# Altium schematic sheet [03] - Module Sim.SchDoc
size 381 x 266 mm
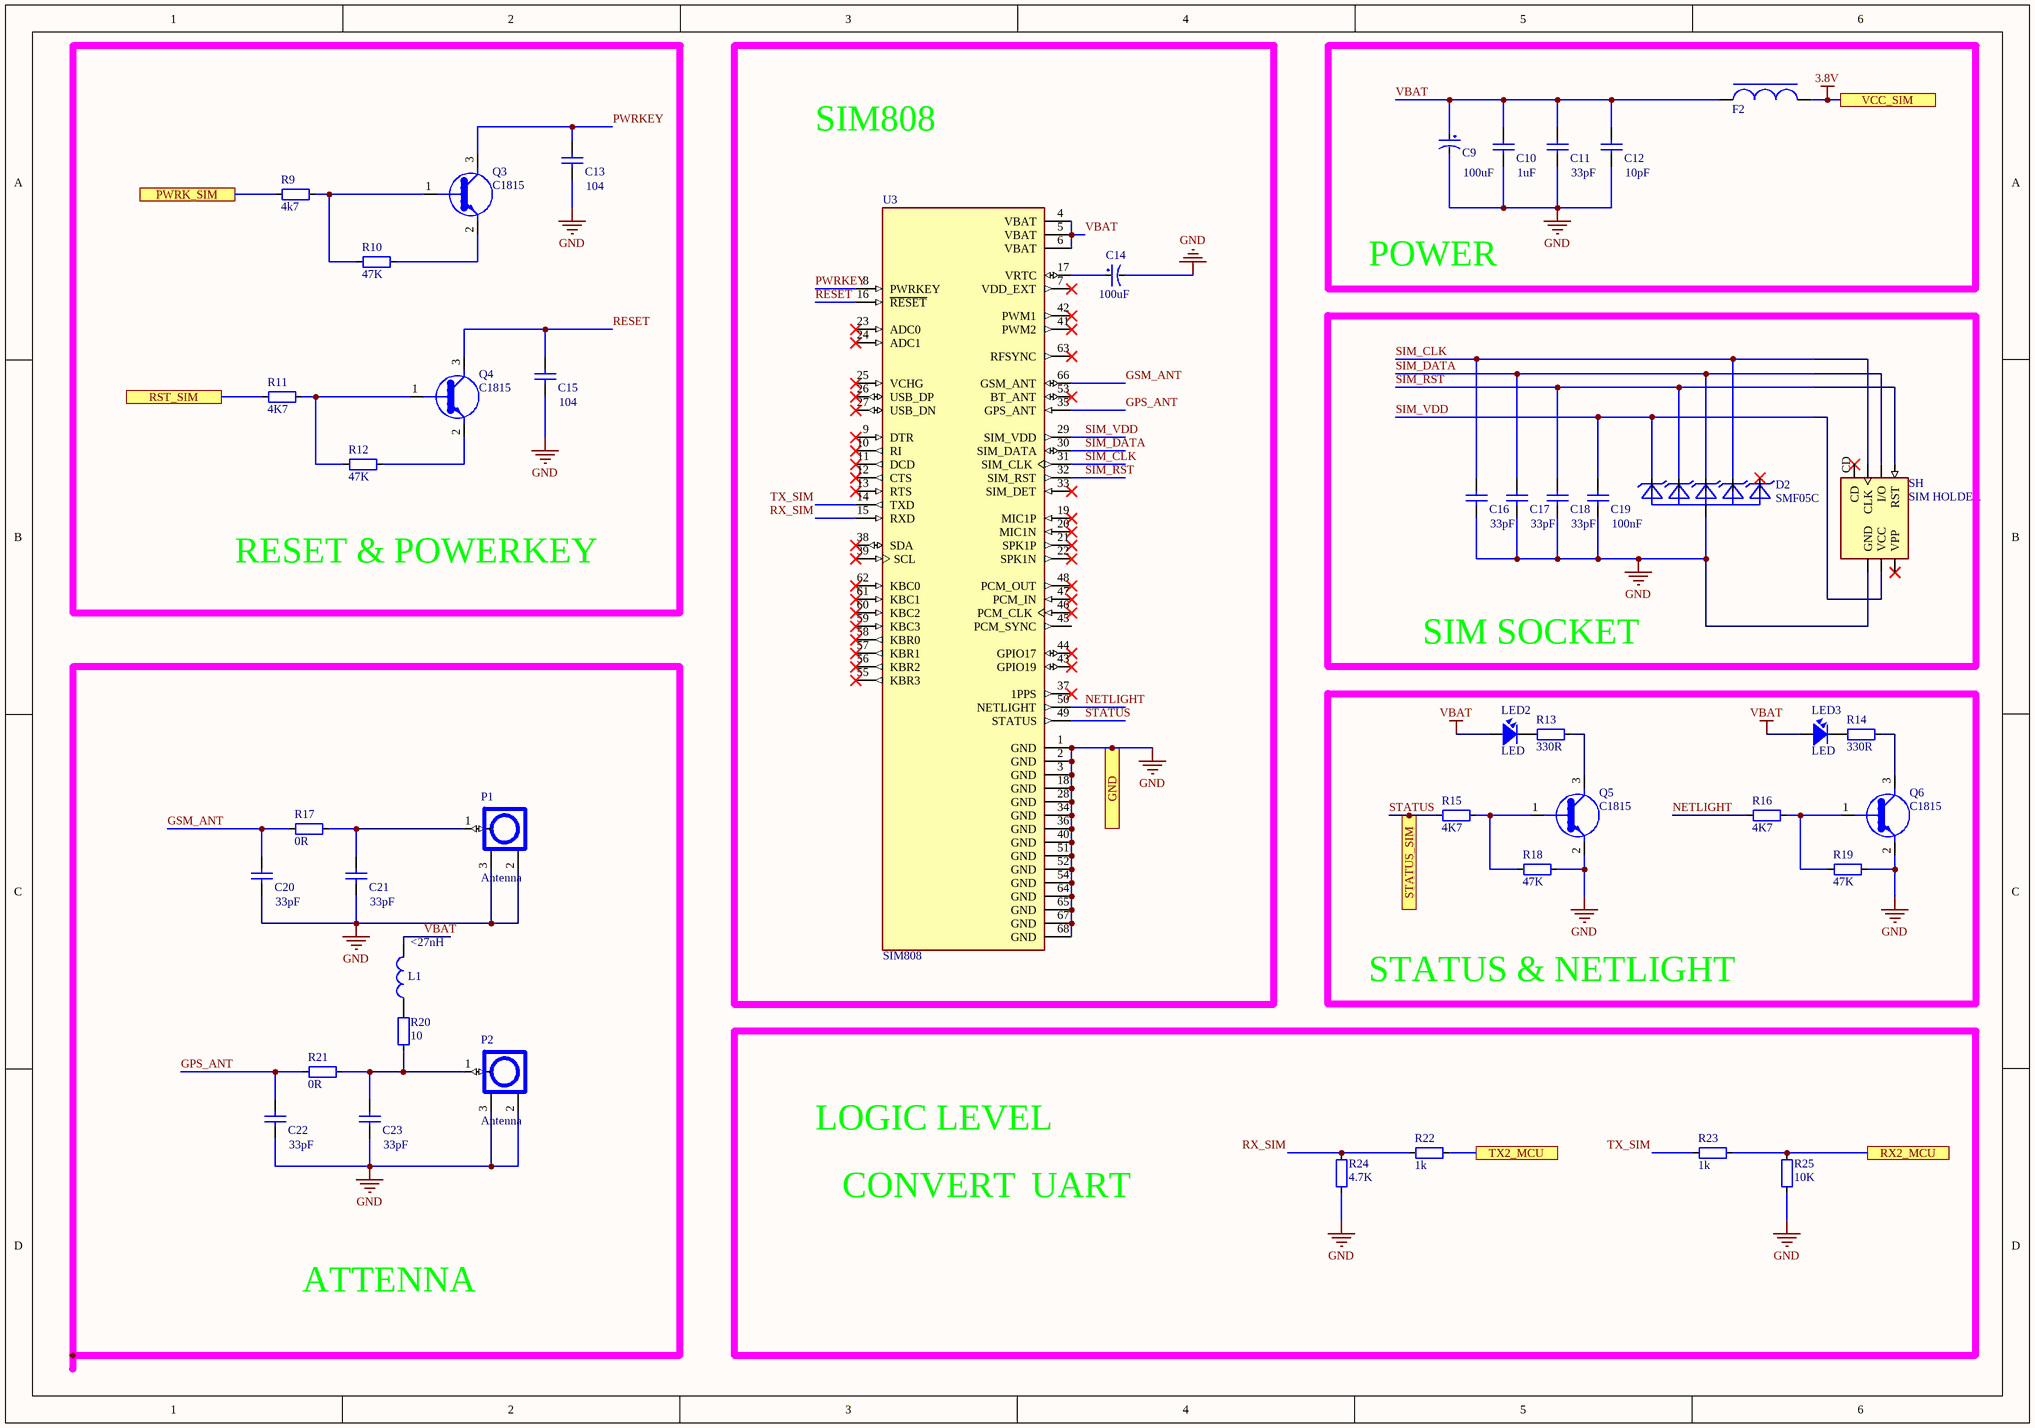
[diagram p0: [03] - Module Sim.SchDoc]

## Parts
C9  100uF  [CAP-ALU-SMD-D]
C10  1uF  [CAP_0805]
C11  33pF  [CAP_0805]
C12  10pF  [CAP_0805]
C13  104  [CAP_0805]
C14  100uF  [CAP-ALU-SMD-D]
C15  104  [CAP_0805]
C16  33pF  [CAP_0805]
C17  33pF  [CAP_0805]
C18  33pF  [CAP_0805]
C19  100nF  [CAP_0805]
C20  33pF  [CAP_0805]
C21  33pF  [CAP_0805]
C22  33pF  [CAP_0805]
C23  33pF  [CAP_0805]
D2  SMF05C  [SC70-6L]
F2  Ferrite Bead  [Ferrite_0805]  (value not drawn)
L1  <27nH  [L-SMD-D-7.3x7.3]
LED2  LED  [LED-0805-Red]
LED3  LED  [LED-0805-Red]
P1  Antenna  [IPXS]
P2  Antenna  [IPXS]
Q3  C1815  [SOT23]
Q4  C1815  [SOT23]
Q5  C1815  [SOT23]
Q6  C1815  [SOT23]
R9  4k7  [RES-SMD-0805]
R10  47K  [RES-SMD-0805]
R11  4K7  [RES-SMD-0805]
R12  47K  [RES-SMD-0805]
R13  330R  [RES-SMD-0805]
R14  330R  [RES-SMD-0805]
R15  4K7  [RES-SMD-0805]
R16  4K7  [RES-SMD-0805]
R17  0R  [RES-SMD-0603]
R18  47K  [RES-SMD-0805]
R19  47K  [RES-SMD-0805]
R20  10  [RES-SMD-0603]
R21  0R  [RES-SMD-0603]
R22  1k  [RES-SMD-0805]
R23  1k  [RES-SMD-0805]
R24  4.7K  [RES-SMD-0805]
R25  10K  [RES-SMD-0805]
SH  SIM HOLDER  [GCT_SIM7100-6-1-15-00-A_REVC]
U3  SIM808  [XCVR_SIM808]

## Ports
GND, PWRK_SIM, RST_SIM, RX2_MCU, STATUS_SIM, TX2_MCU, VCC_SIM

## Nets
3.8V: F2.2 ; port VCC_SIM
GND: C9.2 C10.1 C11.1 C12.1 C13.1 C14.2 C15.1 C16.1 C17.1 C18.1 C19.1 C20.1 C21.1 C22.1 C23.1 D2.2(A) P1.2 P1.3 P2.2 P2.3 Q5.2(E) Q6.2(E) R18.2 R19.2 R24.1 R25.2 SH.C5(GND) U3.1(GND) U3.2(GND) U3.3(GND) U3.18(GND) U3.28(GND) U3.34(GND) U3.36(GND) U3.40(GND) U3.51(GND) U3.52(GND) U3.54(GND) U3.64(GND) U3.65(GND) U3.67(GND) U3.68(GND) ; port GND
VBAT: C9.1 C10.2 C11.2 C12.2 F2.1 L1.2 LED2.1 LED3.1 U3.4(VBAT) U3.5(VBAT) U3.6(VBAT)
GPS_ANT: C22.2 R21.1 U3.35(GPS_ANT)
GSM_ANT: C20.2 R17.1 U3.66(GSM_ANT)
NETLIGHT: R16.1 U3.50(NETLIGHT)
PWRK_SIM: R9.1 ; port PWRK_SIM
PWRKEY: C13.2 Q3.3(C) U3.8(PWRKEY)
RESET: C15.2 Q4.3(C) U3.16(~{RESET})
RST_SIM: R11.1 ; port RST_SIM
RX2_MCU: R23.1 R25.1 ; port RX2_MCU
RX_SIM: R22.2 R24.2 U3.15(RXD)
SIM_CLK: C16.2 D2.5(C4) SH.C3(CLK) U3.31(SIM_CLK)
SIM_DATA: C17.2 D2.4(C3) SH.C7(I/O) U3.30(SIM_DATA)
SIM_RST: C18.2 D2.3(C2) SH.C2(RST) U3.32(SIM_RST)
SIM_VDD: C19.2 D2.1(C1) SH.C1(VCC) U3.29(SIM_VDD)
STATUS: R15.2 U3.49(STATUS) ; port STATUS_SIM
TX2_MCU: R22.1 ; port TX2_MCU
TX_SIM: R23.2 U3.14(TXD)
NetC14_1: C14.1 U3.17(VRTC)
NetC21_2: C21.2 P1.1 R17.2
NetC23_2: C23.2 P2.1 R20.1 R21.2
NetL1_1: L1.1 R20.2
NetLED2_2: LED2.2 R13.1
NetLED3_2: LED3.2 R14.1
NetQ3_1: Q3.1(B) R9.2 R10.1
NetQ3_2: Q3.2(E) R10.2
NetQ4_1: Q4.1(B) R11.2 R12.1
NetQ4_2: Q4.2(E) R12.2
NetQ5_1: Q5.1(B) R15.1 R18.1
NetQ5_3: Q5.3(C) R13.2
NetQ6_1: Q6.1(B) R16.2 R19.1
NetQ6_3: Q6.3(C) R14.2

Not connected (* = marked no-connect by the designer): D2 6(C5)*; SH C6(VPP)* CD*; U3 7(VDD_EXT)* 9(DTR)* 10(RI)* 11(DCD)* 12(CTS)* 13(RTS)* 19(MIC1P)* 20(MIC1N)* 21(SPK1P)* 22(SPK1N)* 23(ADC0)* 24(ADC1)* 25(VCHG)* 26(USB_DP)* 27(USB_DN)* 33(SIM_DET)* 37(1PPS)* 38(SDA)* 39(SCL)* 41(PWM2)* 42(PWM1)* 43(GPIO19)* 44(GPIO17)* 45(PCM_SYNC) 46(PCM_CLK)* 47(PCM_IN)* 48(PCM_OUT)* 53(BT_ANT)* 55(KBR3)* 56(KBR2)* 57(KBR1)* 58(KBR0)* 59(KBC3)* 60(KBC2)* 61(KBC1)* 62(KBC0)* 63(RFSYNC)*

## Notes on the sheet
- SIM808
- POWER
- RESET & POWERKEY
- SIM SOCKET
- STATUS & NETLIGHT
- LOGIC LEVEL
- CONVERT
- UART
- ATTENNA

## Library data of the parts
C9 C14 = Cap_ALU_Smd: Capacitor ALU SMD
C10-C13 C15-C23 = CapSMD: Capacitor; Value: 33p; Published: 8-Jun-2000; LatestRevisionDate: 17-Jul-2002; LatestRevisionNote: Re-released for DXP Platform.; PackageReference: RAD-0.3; Publisher: Altium Limited
D2 = SMF05C: 12.5V Clamp 8A _8/20Âµs_ Ipp Tvs Diode Surface Mount SC-88/SC70-6/SOT-363; Manufacturer: Semtech; Manufacturer Part Number: SMF05C.TCT; MF: ON Semiconductor; Direction: Unidirectional; Capacitance: 130pF; Reverse Breakdown Voltage: 6V; Number of Elements: 5; Element Configuration: Common Anode; Reverse Standoff Voltage: 5V; Peak Pulse Power: 100W; Power Line Protection: No; Leakage Current: 5uA; Test Current: 1mA; ESD Protection: Yes; Diode Type: ZENER; Availability: Unavailable; Price: None; Package: SOT-363 ON Semiconductor; Value: *; SnapEDA_Link: https://www.snapeda.com/parts/SMF05C/ON%20Semiconductor/view-part/2782704/?ref=snap; MP: SMF05C; Supplier 1: Digi-Key; Stock 1: 29664; Pricing 1: 1=0.87, 10=0.762, 100=0.5844, 500=0.462, 1000=0.3696 (USD); Mount: Surface Mount; Case/Package: SC; Number of Pins: 6; Min Operating Temperature: -55°C; Max Operating Temperature: 125°C; Packaging: Tape and Reel; Number of Channels: 5; Number of Unidirectional Channels: 5; Min Breakdown Voltage: 6V; Clamping Voltage: 12.5V; Working Voltage: 5V; Peak Pulse Current: 8A; Polarity: Unidirectional; Max Reverse Leakage Current: 5uA; Max Breakdown Voltage: 6V; Voltage Rating (DC): 5V; Operating Supply Voltage: 5V; Resistor Type: Zener; Series: SMF; Clamping Voltage-Max: 12.5V; Length: 2mm; Width: 1.25mm; Height: 0.9mm; Depth: 1.25mm; Radiation Hardening: No; Lead Free: Lead Free; RoHS Compliant: Yes; ComponentLink1URL: http://www.semtech.com/images/datasheet/smf05c.pdf?src-supplier=Future+Electronics; ComponentLink1Description: http://www.semtech.com/images/datasheet/smf05c.pdf?src-supplier=Future+Electronics; ComponentLink2URL: https://www.semtech.com/uploads/documents/smf05c.pdf?src-supplier=Verical; ComponentLink2Description: https://www.semtech.com/uploads/documents/smf05c.pdf?src-supplier=Verical; ComponentLink3URL: https://www.semtech.com/uploads/documents/smf05c.pdf?src-supplier=Digi-Key; ComponentLink3Description: https://www.semtech.com/uploads/documents/smf05c.pdf?src-supplier=Digi-Key; Supplier Part Number 1: SMF05CDKR-ND; ComponentLink4Description: https://banlinhkien.com/smf05c-sot363-tvs-diode-esd-protection-p6646402.html; ComponentLink4URL: https://banlinhkien.com/smf05c-sot363-tvs-diode-esd-protection-p6646402.html
F2 = Ferrite Bead: Manufacturer: Murata; Manufacturer Part Number: BLM21PG300SN1D; Material: Steel,Ferrite; Frequency: 100MHz; Resistance: 15mR; Tolerance: 25%; Impedance: 30R; Max Current Rating: 4A; Number of Lines: 1; DC Resistance (DCR): 14mR; Max DC Current: 3A; Shielding: Unshielded; Stock 1: 0; Pricing 1: 4000=0.03102, 8000=0.02895, 12000=0.02688, 28000=0.02657, 100000=0.02585 (USD); Case/Package: 0805; Number of Pins: 2; Core Material: Ferrite; Case Code (Metric): 2012; Case Code (Imperial): 0805; Min Operating Temperature: -55°C; Max Operating Temperature: 125°C; Packaging: Tape and Reel; Package Quantity: 1; Current Rating: 4A; Termination: SMD/SMT; Test Frequency: 100MHz; DC Current: 3A; Number of Circuits: 1; Series: BLM21P; DC Resistance-Max: 14mR; Length: 2mm; Width: 1.25mm; Height: 0.85mm; Depth: 1.25mm; Radiation Hardening: No; Lead Free: Lead Free; RoHS Compliant: Yes; REACH SVHC: No SVHC; Military Standard: Not; ComponentLink1URL: http://search.murata.co.jp/Ceramy/image/img/PDF/ENG/L0110S0100BLM21P.pdf?src-supplier=Avnet; ComponentLink1Description: http://search.murata.co.jp/Ceramy/image/img/PDF/ENG/L0110S0100BLM21P.pdf?src-supplier=Avnet; ComponentLink2URL: https://www.murata.com/en-us/products/productdata/8796738977822/ENFA0005.pdf?src-supplier=Digi-Key; ComponentLink2Description: https://www.murata.com/en-us/products/productdata/8796738977822/ENFA0005.pdf?src-supplier=Digi-Key; ComponentLink3URL: http://www.farnell.com/datasheets/1756152.pdf?src-supplier=Element14; ComponentLink3Description: http://www.farnell.com/datasheets/1756152.pdf?src-supplier=Element14; ComponentLink4URL: http://uk.rs-online.com/webdocs/002e/0900766b8002e1f1.pdf?src-supplier=RSComponents; ComponentLink4Description: http://uk.rs-online.com/webdocs/002e/0900766b8002e1f1.pdf?src-supplier=RSComponents; ComponentLink5URL: http://www.murata.com/en-global/api/pdfdownloadapi?cate=luNoiseSupprFilteChipFerriBead&partno=BLM21PG300SN1%23&src-supplier=Future+Electronics; ComponentLink5Description: http://www.murata.com/en-global/api/pdfdownloadapi?cate=luNoiseSupprFilteChipFerriBead&partno=BLM21PG300SN1%23&src-supplier=Future+Electronics; ComponentLink6URL: http://www.jameco.com/Jameco/Products/ProdDS/1845339.pdf?src-supplier=Jameco; ComponentLink6Description: http://www.jameco.com/Jameco/Products/ProdDS/1845339.pdf?src-supplier=Jameco; ComponentLink7URL: http://search.murata.co.jp/Ceramy/image/img/PDF/ENG/L0110S0100BLM21P.pdf?src-supplier=Avnet+Europe; ComponentLink7Description: http://search.murata.co.jp/Ceramy/image/img/PDF/ENG/L0110S0100BLM21P.pdf?src-supplier=Avnet+Europe; ComponentLink8URL: http://www.produktinfo.conrad.com/datenblaetter/1100000-1199999/001172365-da-01-en-DROSSEL_0805_30R0_2_0X1_25MM_4000ST.pdf?src-supplier=Conrad; ComponentLink8Description: http://www.produktinfo.conrad.com/datenblaetter/1100000-1199999/001172365-da-01-en-DROSSEL_0805_30R0_2_0X1_25MM_4000ST.pdf?src-supplier=Conrad; Supplier 1: Digi-Key; Supplier Part Number 1: 490-1052-2-ND; ComponentLink9Description: https://banlinhkien.vn/goods-9788-ferrite-beads-100-ohm-nfz2msm101sn10l.htmlhttps://banlinhkien.vn/goods-9788-ferrite-beads-100-ohm-nfz2msm101sn10l.html; ComponentLink9URL: https://banlinhkien.vn/goods-9788-ferrite-beads-100-ohm-nfz2msm101sn10l.html
L1 = Inductor
LED2 LED3 = LED: LED Single colour Green and Red; Value: LED 3 ly Single Colour
P1 P2 = IPXSx66: Antenna GSM GPS
Q3-Q6 = C1815: Bipolar _BJT_ Transistor NPN 25V 1.5A 100MHz 300mW Surface Mount SOT-23; Manufacturer: MCC; Manufacturer Part Number: MMSS8050-L-TP; MF: Comchip Technology; MP: SS8050-G; hFE Min: 40; Max Power Dissipation: 625mW; Collector Emitter Voltage (VCEO): 500mV; Collector Base Voltage (VCBO): 40V; Emitter Base Voltage (VEBO): 5V; Element Configuration: Single; Value: *; Digi-Key_Purchase_URL: https://www.digikey.in/product-detail/en/comchip-technology/SS8050-G/641-1790-1-ND/6138954?utm_source=snapeda&utm_medium=aggregator&utm_campaign=symbol; Package: TO-236 Comchip; SnapEDA_Link: https://www.snapeda.com/parts/SS8050-G/Comchip%20Technology/view-part/809142/?ref=snap; Digi-Key_Part_Number: 641-1790-1-ND; Supplier 1: Digi-Key; Stock 1: 0; Pricing 1: 3000=0.0346, 6000=0.03121, 15000=0.02714, 30000=0.02442, 75000=0.02171 (USD); Mount: Surface Mount; Case/Package: TO-236-3; Min Operating Temperature: -55°C; Max Operating Temperature: 150°C; Packaging: Tape and Reel; Package Quantity: 3000; Max Collector Current: 1.5A; Transition Frequency: 100MHz; Polarity: NPN; Collector Emitter Saturation Voltage: 500mV; Collector Emitter Breakdown Voltage: 25V; Max Breakdown Voltage: 25V; Gain Bandwidth Product: 100MHz; Series: -; Collector-emitter Voltage-Max: 500mV; Lead Free: Lead Free; RoHS Compliant: Yes; ComponentLink1URL: http://www.mouser.com/ds/2/258/MMSS8050(SOT-23)-276387.pdf?src-supplier=Mouser; ComponentLink1Description: http://www.mouser.com/ds/2/258/MMSS8050(SOT-23)-276387.pdf?src-supplier=Mouser; ComponentLink2URL: http://www.mccsemi.com/up_pdf/MMSS8050(SOT-23).pdf?src-supplier=Digi-Key; ComponentLink2Description: http://www.mccsemi.com/up_pdf/MMSS8050(SOT-23).pdf?src-supplier=Digi-Key; ComponentLink3URL: https://www.mccsemi.com/pdf/Products/MMSS8050(SOT-23).pdf?src-supplier=Digi-Key; ComponentLink3Description: https://www.mccsemi.com/pdf/Products/MMSS8050(SOT-23).pdf?src-supplier=Digi-Key; Supplier Part Number 1: MMSS8050-L-TPMSTR-ND; ComponentLink4Description: https://banlinhkien.vn/goods-946-c1815-2sc1815-sot23-npn-hf-smd-.html; ComponentLink4URL: https://banlinhkien.vn/goods-946-c1815-2sc1815-sot23-npn-hf-smd-.html
R9-R25 = Resistor - SMD: Resistor; Manufacturer: Generic Components; Class: Passive; Published: 08/06/2000; Publisher: Altium Hobart Technology Centre
SH = SIM HOLDER: 7 _6 + 1_ Position Card Connector Micro SIM Surface Mount, Right Angle Gold; MP: SIM7100-6-1-15-00-A; MF: Global Connector Technology; Package: None; Availability: Unavailable; SnapEDA_Link: https://www.snapeda.com/parts/SIM7100-6-1-15-00-A/Global%20Connector%20Technology/view-part/449163/?ref=snap; Price: None; Value: *
U3 = SIM808: SIM808 GPS, GPRS/GSM RF Arduino Platform Evaluation Expansion Board; MF: Adafruit Industries; MP: SIM808; Package: None; SnapEDA_Link: https://www.snapeda.com/parts/SIM808/SIMcom%20Wireless%20solutions%20Co.%2CLtd/view-part/424834/?ref=snap; Availability: Unavailable; Price: None; Value: *; ComponentLink1Description: https://banlinhkien.com/sim808-p6650749.html; ComponentLink1URL: https://banlinhkien.com/sim808-p6650749.html